# Altium schematic sheet sw_receive.SchDoc
size A3
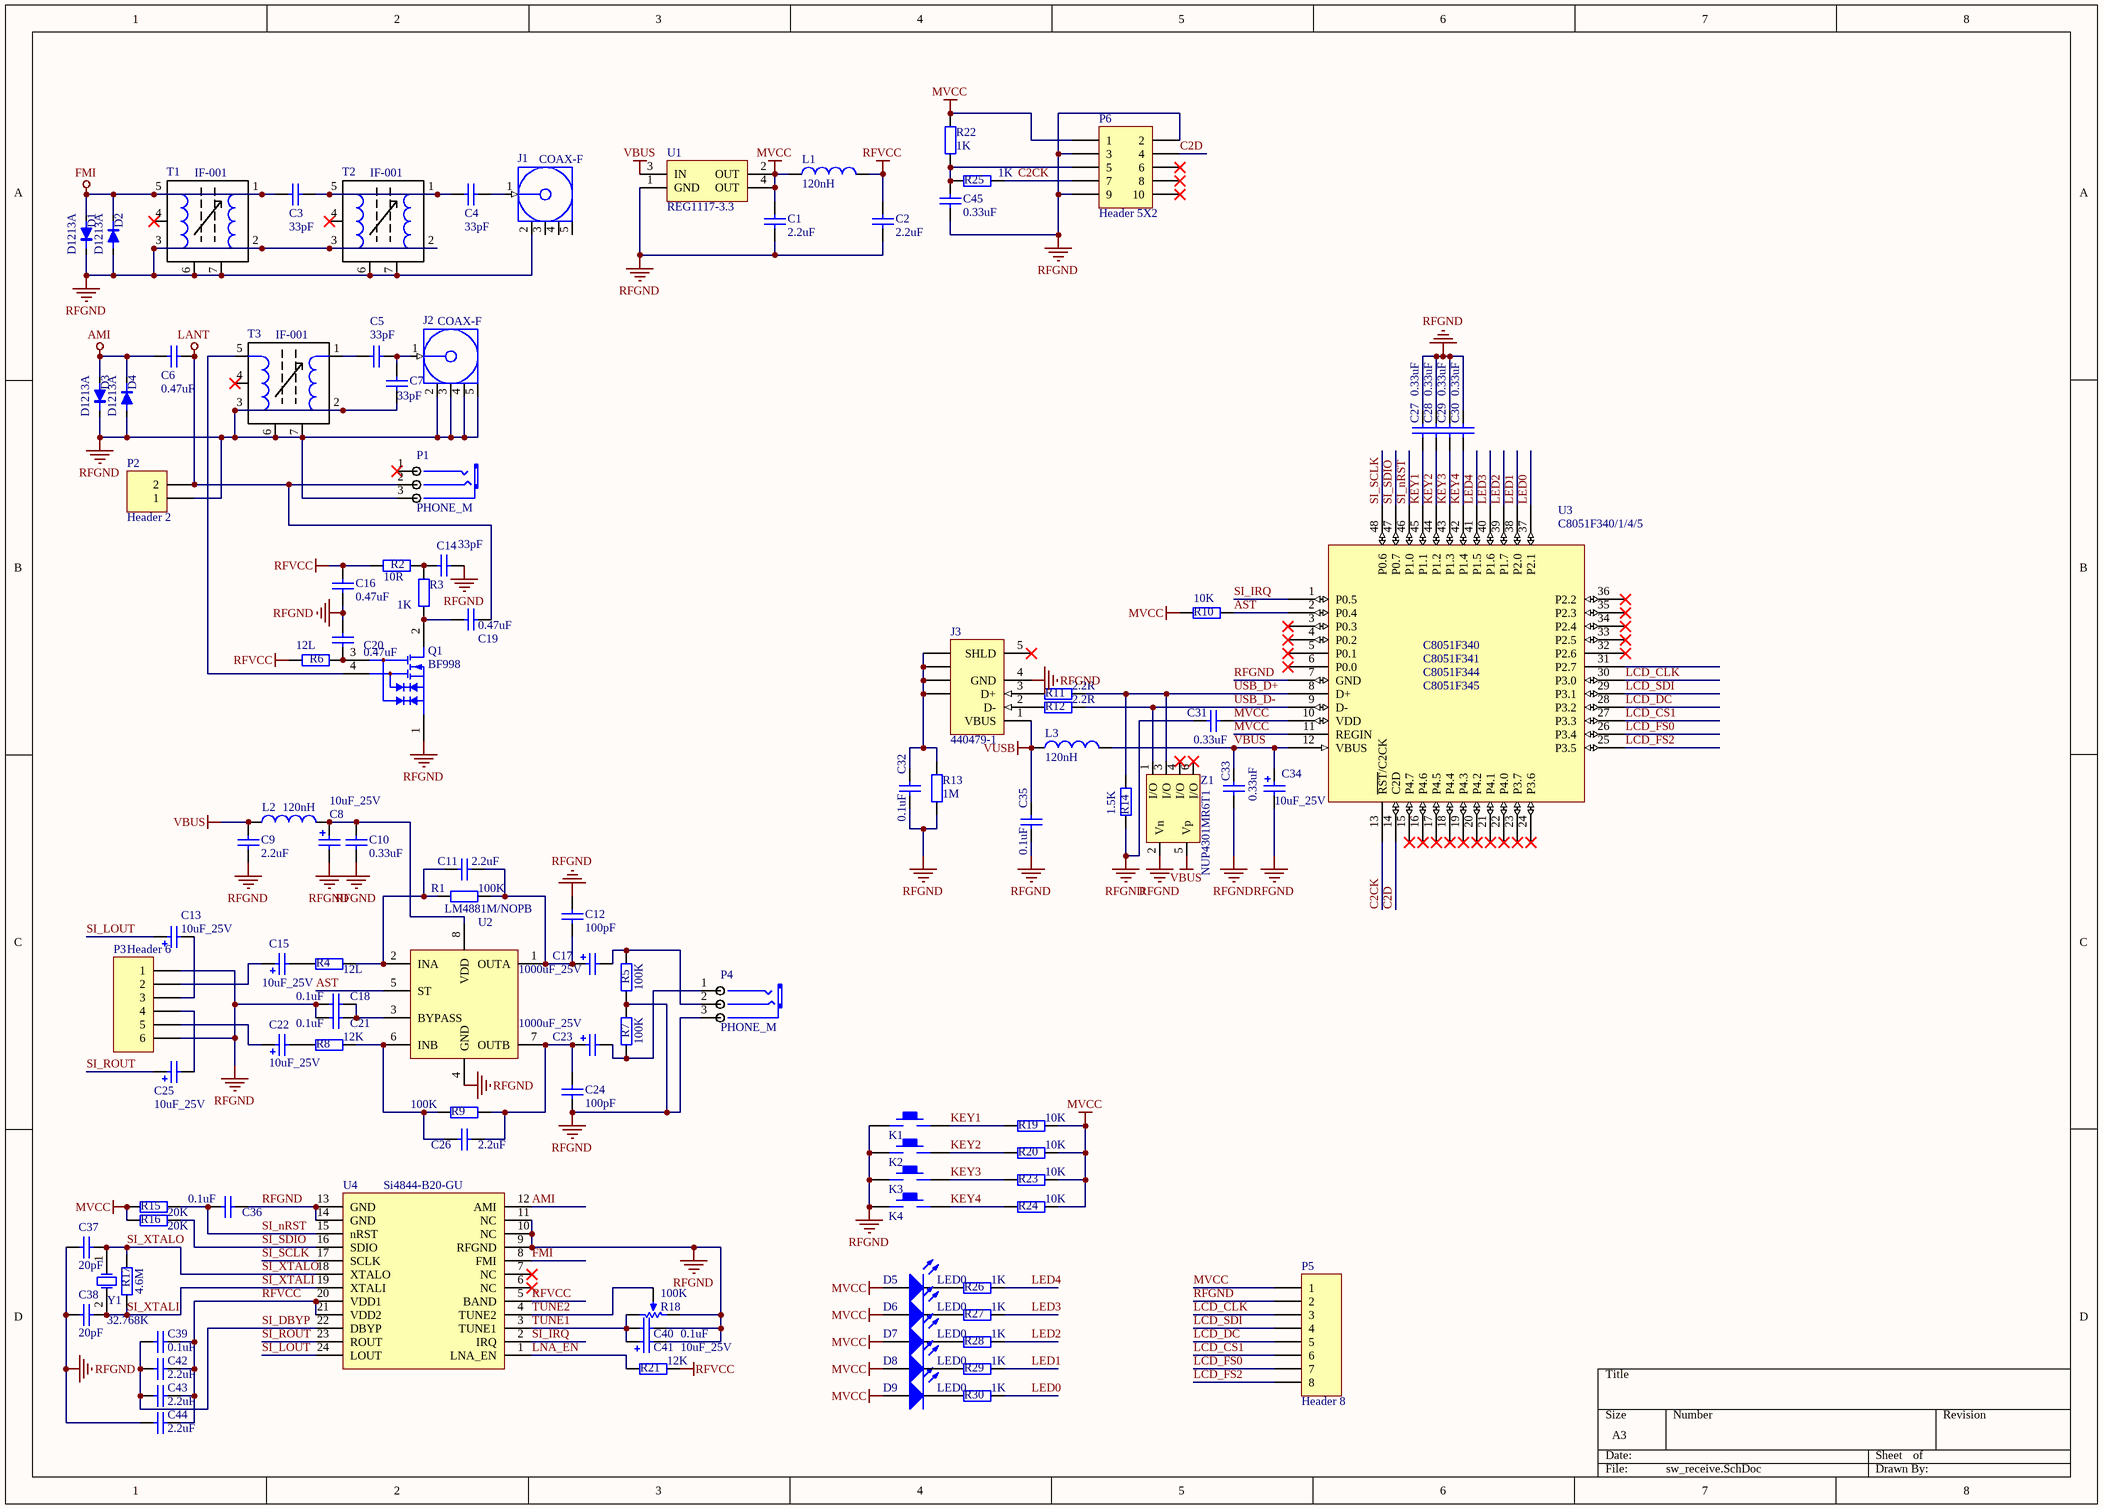
[diagram p0: sw_receive.SchDoc]

## Parts
C1  2.2uF  [0805C]
C2  2.2uF  [0805C]
C3  33pF  [0805C]
C4  33pF  [0805C]
C5  33pF  [0805C]
C6  0.47uF  [0805C]
C7  33pF  [0805C]
C8  10uF_25V  [RB2.5-6.3]
C9  2.2uF  [0805C]
C10  0.33uF  [0805C]
C11  2.2uF  [0805C]
C12  100pF  [0805C]
C13  10uF_25V  [RB2-5]
C14  33pF  [0805C]
C15  10uF_25V  [RB2-5]
C16  0.47uF  [0805C]
C17  1000uF_25V  [RB3.5-8]
C18  0.1uF  [CAPC3225L]
C19  0.47uF  [0805C]
C20  0.47uF  [0805C]
C21  0.1uF  [0805C]
C22  10uF_25V  [RB2-5]
C23  1000uF_25V  [RB3.5-8]
C24  100pF  [0805C]
C25  10uF_25V  [RB2-5]
C26  2.2uF  [0805C]
C27  0.33uF  [0805C]
C28  0.33uF  [0805C]
C29  0.33uF  [0805C]
C30  0.33uF  [0805C]
C31  0.33uF  [0805C]
C32  0.1uF  [0805C]
C33  0.33uF  [0805C]
C34  10uF_25V  [RB2.5-6.3]
C35  0.1uF  [0805C]
C36  0.1uF  [0805C]
C37  20pF  [0805C]
C38  20pF  [0805C]
C39  0.1uF  [0805C]
C40  0.1uF  [0805C]
C41  10uF_25V  [RB2.5-6.3]
C42  2.2uF  [CAPC3225L]
C43  2.2uF  [CAPC3225L]
C44  2.2uF  [CAPC3225L]
C45  0.33uF  [0805C]
D1  D1213A  [SOD-323]
D2  D1213A  [SOD-323]
D3  D1213A  [SOD-323]
D4  D1213A  [SOD-323]
D5  LED0  [LEDLight]
D6  LED0  [LEDLight]
D7  LED0  [LEDLight]
D8  LED0  [LEDLight]
D9  LED0  [LEDLight]
J1  COAX-F  [MCX5.08-H5]
J2  COAX-F  [MCX5.08-H5]
J3  440479-1  [440479]
K1  KEY_M  [KEY_M]  (value not drawn)
K2  KEY_M  [KEY_M]  (value not drawn)
K3  KEY_M  [KEY_M]  (value not drawn)
K4  KEY_M  [KEY_M]  (value not drawn)
L1  120nH  [0805R]
L2  120nH  [0805R]
L3  120nH  [3225[1210]]
P1  PHONE_M  [PHONE_ST]
P2  Header 2  [2510-2]
P3  Header 6  [RK097]
P4  PHONE_M  [PHONE_ST]
P5  Header 8  [HDR1X8]
P6  Header 5X2  [FKV10SN]
Q1  BF998  [SOT143]
R1  100K  [0805R]
R2  10R  [0805R]
R3  1K  [0805R]
R4  12L  [0805R]
R5  100K  [0805R]
R6  12L  [0805R]
R7  100K  [0805R]
R8  12K  [0805R]
R9  100K  [0805R]
R10  10K  [0805R]
R11  2.2R  [0805R]
R12  2.2R  [0805R]
R13  1M  [0805R]
R14  1.5K  [0805R]
R15  20K  [0805R]
R16  20K  [0805R]
R17  4.6M  [0805R]
R18  100K  [3590S]
R19  10K  [0805R]
R20  10K  [0805R]
R21  12K  [0805R]
R22  1K  [0805R]
R23  10K  [0805R]
R24  10K  [0805R]
R25  1K  [0805R]
R26  1K  [0805R]
R27  1K  [0805R]
R28  1K  [0805R]
R29  1K  [0805R]
R30  1K  [0805R]
T1  IF-001  [IF_10X10]
T2  IF-001  [IF_10X10]
T3  IF-001  [IF_10X10]
U1  REG1117-3.3  [ZZ311]
U2  LM4881M/NOPB  [SO-8]
U3  C8051F340/1/4/5  [TQFP-48]
U4  Si4844-B20-GU  [SSOP24-0.635]
Y1  32.768K  [Crystal32]
Z1  NUP4301MR6T1  [TSOP-6]

## Nets
AMI: C6.1 D3.1(A) D4.2(K) U4.12(AMI)
FMI: C3.2 D1.1(A) D2.2(K) T1.1 T1.5 U4.8(FMI)
LANT: C6.2 C19.1 P1.2(CHR) P2.2
MVCC: C1.2 C31.1 D5.1(A) D6.1(A) D7.1(A) D8.1(A) D9.1(A) L1.1 P5.1 P6.1 R10.1 R15.1 R16.1 R19.2 R20.2 R22.2 R23.2 R24.2 U1.2(OUT) U1.4(OUT) U3.10(VDD) U3.11(REGIN)
RFGND: C1.1 C2.1 C7.2 C8.2 C9.1 C10.1 C12.2 C14.2 C16.1 C18.1 C20.2 C21.1 C24.2 C27.1 C28.1 C29.1 C30.1 C31.2 C32.2 C33.1 C34.2 C35.2 C36.2 C37.2 C38.2 C40.2 C41.2 C44.1 C45.1 D1.2(K) D2.1(A) D3.2(K) D4.1(A) J1.2(GND) J2.2(GND) J2.3(GND) J2.4(GND) J2.5(GND) J3.4(GND) K1.1 K2.1 K3.1 K4.1 P1.3(COM) P2.1 P3.1 P3.6 P4.3(COM) P5.2 P6.2 P6.3 P6.9 Q1.1(S) R5.2 R7.2 R13.1 R14.1 R18.2(BOT) T1.2 T1.3 T1.6 T1.7 T2.2 T2.3 T2.6 T2.7 T3.2 T3.3 T3.6 T3.7 U1.1(GND) U2.4(GND) U3.7(GND) U4.9(RFGND) U4.10(NC) U4.11(NC) U4.13(GND) U4.14(GND) Z1.2(Vn)
RFVCC: C2.2 C16.2 C39.2 C42.2 C43.2 C44.2 L1.2 R2.2 R6.2 R21.2 U4.5(BAND) U4.20(VDD1) U4.21(VDD2)
VBUS: C9.2 C33.2 C34.1 L2.1 L3.2 U1.3(IN) U3.12(VBUS) Z1.5(Vp)
VUSB: C35.1 J3.1(VBUS) L3.1
AST: R10.2 U2.5(ST) U3.2(P0.4)
C2CK: P6.7 R25.2 U3.13(~{RST}/C2CK)
C2D: P6.4 U3.14(C2D)
KEY1: C27.2 K1.2 R19.1 U3.45(P1.1)
KEY2: C28.2 K2.2 R20.1 U3.44(P1.2)
KEY3: C29.2 K3.2 R23.1 U3.43(P1.3)
KEY4: C30.2 K4.2 R24.1 U3.42(P1.4)
LCD_CLK: P5.3 U3.30(P3.0)
LCD_CS1: P5.6 U3.27(P3.3)
LCD_DC: P5.5 U3.28(P3.2)
LCD_FS0: P5.7 U3.26(P3.4)
LCD_FS2: P5.8 U3.25(P3.5)
LCD_SDI: P5.4 U3.29(P3.1)
LED0: R30.1 U3.37(P2.1)
LED1: R29.1 U3.38(P2.0)
LED2: R28.1 U3.39(P1.7)
LED3: R27.1 U3.40(P1.6)
LED4: R26.1 U3.41(P1.5)
LNA_EN: R21.1 U4.1(LNA_EN)
SI_DBYP: C39.1 C42.1 C43.1 U4.22(DBYP)
SI_IRQ: U3.1(P0.5) U4.2(IRQ)
SI_LOUT: C13.1 U4.24(LOUT)
SI_nRST: C36.1 R15.2 U3.46(P1.0) U4.15(nRST)
SI_ROUT: C25.1 U4.23(ROUT)
SI_SCLK: U3.48(P0.6) U4.17(SCLK)
SI_SDIO: R16.2 U3.47(P0.7) U4.16(SDIO)
SI_XTALI: C38.1 R17.1 U4.19(XTALI) Y1.2(OSC2)
SI_XTALO: C37.1 R17.2 U4.18(XTALO) Y1.1(OSC1)
TUNE1: C40.1 C41.1 R18.1(TOP) U4.3(TUNE1)
TUNE2: R18.3(TAP) U4.4(TUNE2)
USB_D+: R11.2 R14.2 U3.8(D+) Z1.3(I/O)
USB_D-: R12.2 U3.9(D-) Z1.1(I/O)
NetC3_1: C3.1 C4.2 T2.1 T2.5
NetC4_1: C4.1 J1.1(Signal)
NetC5_1: C5.1 C7.1 J2.1(Signal)
NetC5_2: C5.2 T3.1
NetC8_1: C8.1 C10.2 L2.2 U2.8(VDD)
NetC11_1: C11.1 R1.1 R4.2 U2.2(INA)
NetC11_2: C11.2 C12.1 C17.1 R1.2 U2.1(OUTA)
NetC13_2: C13.2 P3.3
NetC14_1: C14.1 R2.1 R3.2
NetC15_1: C15.1 P3.2
NetC15_2: C15.2 R4.1
NetC17_2: C17.2 P4.2(CHR) R5.1
NetC18_2: C18.2 C21.2 U2.3(BYPASS)
NetC19_2: C19.2 Q1.2(D) R3.1
NetC20_1: C20.1 Q1.3(G2) R6.1
NetC22_1: C22.1 P3.5
NetC22_2: C22.2 R8.1
NetC23_1: C23.1 C24.1 C26.2 R9.1 U2.7(OUTB)
NetC23_2: C23.2 P4.1(CHL) R7.1
NetC25_2: C25.2 P3.4
NetC26_1: C26.1 R8.2 R9.2 U2.6(INB)
NetC32_1: C32.1 J3.6(SHLD) J3.7(SHLD) J3.8(SHLD) J3.9(SHLD) R13.2
NetC45_2: C45.2 P6.5 R22.1 R25.1
NetD5_2: D5.2(K) R26.2
NetD6_2: D6.2(K) R27.2
NetD7_2: D7.2(K) R28.2
NetD8_2: D8.2(K) R29.2
NetD9_2: D9.2(K) R30.2
NetJ3_2: J3.2(D-) R12.1
NetJ3_3: J3.3(D+) R11.1
NetQ1_4: Q1.4(G1) T3.5

Not connected (* = marked no-connect by the designer): J1 3(GND) 4(GND) 5(GND); J3 5(SHLD)*; P1 1(CHL)*; P6 6* 8* 10*; T1 4*; T2 4*; T3 4*; U3 3(P0.3)* 4(P0.2)* 5(P0.1)* 6(P0.0)* 15(P4.7)* 16(P4.6)* 17(P4.5)* 18(P4.4)* 19(P4.3)* 20(P4.2)* 21(P4.1)* 22(P4.0)* 23(P3.7)* 24(P3.6)* 31(P2.7) 32(P2.6)* 33(P2.5)* 34(P2.4)* 35(P2.3)* 36(P2.2)*; U4 6(NC)* 7(NC)*; Z1 4(I/O)* 6(I/O)*

## Notes on the sheet
- (in symbol C8051F340/1/4/5) C8051F340; C8051F341; C8051F344; C8051F345

## Library data of the parts
C1-C7 C9-C11 C14 C16 C18-C21 C26-C33 C35-C40 C42-C45 = Cap: Capacitor; Value: 100pF; Published: 8-Jun-2000; LatestRevisionDate: 17-Jul-2002; LatestRevisionNote: Re-released for DXP Platform.; PackageReference: RAD-0.3; Publisher: Altium Limited
C8 C13 C15 C17 C22 C23 C25 C34 C41 = Cap Pol2: Polarized Capacitor (Axial); Value: 100pF; Published: 8-Jun-2000; LatestRevisionDate: 17-Jul-2002; LatestRevisionNote: Re-released for DXP Platform.; PackageReference: POLAR0.8; Publisher: Altium Limited
C12 C24 = Cap: Capacitor; Published: 8-Jun-2000; LatestRevisionDate: 17-Jul-2002; LatestRevisionNote: Re-released for DXP Platform.; PackageReference: RAD-0.3; Publisher: Altium Limited; Value: 100pF
D1-D4 = DIODE1
D5-D9 = LED0: Typical INFRARED GaAs LED; Published: 8-Jun-2000; LatestRevisionDate: 08-Jul-2005; LatestRevisionNote: Mech Layer 1 removed.; PackageReference: LED-0; Publisher: Altium Limited
J1 J2 = COAX-F: RF Coaxial PCB Connector, MCX; Thru-Hole, Right-Angle Mount Socket, Blunt Post Terminal, 50 Ohm Impedance; PCB_Layout: Complies with manufacturer's recommendation.; DrillSize: Corresponds to nominal value.; Published: 15-Jul-2004; LatestRevisionDate: 15-Jul-2004; LatestRevisionNote: Component Replaced.; DatasheetDocument: 30-May-2003; PackageDocument: 04-Jul-1999; PackageReference: 919-119J-51AX; Publisher: Altium Limited; ComponentLink1Description: Manufacturer Link; ComponentLink1URL: http://www.amphenolrf.com/
J3 = 440479-1: USB 2.0, Right Angle, SMT, AB Type, Receptacle, 5 Position, Black; ContactMaterial: Phosphor Bronze; ContactPlating: Gold (30) over Nickel; PCB_Layout: Complies with manufacturer's recommendation.; DrillSize: Corresponds to nominal value.; PanelGround: Without; Published: 15-Jul-2004; DatasheetDocument: 28-Jan-2003; PackageDocument: 28-Jan-2003; PackageReference: 440479; Publisher: Altium Limited; HousingMaterial: Thermoplastic; ComponentLink1Description: Manufacturer Link; ComponentLink1URL: http://www.tycoelectronics.com/; ComponentLink2Description: Packaging Specification; ComponentLink2URL: http://ecommas.tycoelectronics.com/commerce/DocumentDelivery/DDEController?Action=showdoc&DocId=Customer+Drawing%7F440479%7FD%7Fpdf%7FEnglish%7FC_440479_D.pdf
L1-L3 = Inductor: Code_IEC: 1005; Value: 10mH; Published: 8-Jun-2000; LatestRevisionDate: 17-Jul-2002; LatestRevisionNote: Re-released for DXP Platform.; PackageReference: 0402-A; Publisher: Altium Limited; Code_JEITA: 0402
P2 = Header 2: Header, 2-Pin; LatestRevisionDate: 17-Jul-2002; LatestRevisionNote: Re-released for DXP Platform.; Publisher: Altium Limited
P3 = Header 6: Header, 6-Pin; LatestRevisionDate: 17-Jul-2002; LatestRevisionNote: Re-released for DXP Platform.; Publisher: Altium Limited
P5 = Header 8: Header, 8-Pin; LatestRevisionDate: 17-Jul-2002; LatestRevisionNote: Re-released for DXP Platform.; Publisher: Altium Limited
P6 = Header 5X2: Header, 5-Pin, Dual row; LatestRevisionDate: 17-Jul-2002; LatestRevisionNote: Re-released for DXP Platform.; Publisher: Altium Limited
Q1 = BF998: Silicon N-channel Dual-gate MOSFET; Published: 17-Sep-2003; DatasheetVersion: Aug-1996; PackageVersion: Sep-1996; PackageReference: SOT143; Publisher: Altium Limited; PackageDescription: SOT-143; 4 Leads; Body 3 x 2.5 mm, inc. leads (LxW max); ComponentLink1Description: Manufacturer Link; ComponentLink1URL: http://www.semiconductors.philips.com/; ComponentLink2Description: Datasheet; ComponentLink2URL: http://www.semiconductors.philips.com/acrobat/datasheets/BF998_2.pdf
R1 R2 R4-R17 R19-R21 R23 R24 = Res2: Resistor; Value: 1K; Published: 8-Jun-2000; LatestRevisionDate: 17-Jul-2002; LatestRevisionNote: Re-released for DXP Platform.; PackageReference: AXIAL-0.4; Publisher: Altium Limited
R3 R22 R25-R30 = Res2: Resistor; Published: 8-Jun-2000; LatestRevisionDate: 17-Jul-2002; LatestRevisionNote: Re-released for DXP Platform.; PackageReference: AXIAL-0.4; Publisher: Altium Limited; Value: 1K
R18 = RPot: Potentiometer; Sim Note: Enter the Resistance value and the set point into parameter fields.; Set Position: 0.5; Value: 1K; Published: 8-Jun-2000; LatestRevisionDate: 17-Jul-2002; LatestRevisionNote: Re-released for DXP Platform.; PackageReference: VR5; Publisher: Altium Limited
U1 = REG1117-3.3: 800mA and 1A Low Dropout Positive Regulator 2.85V, 3.3V, 5V, and Adjustable; Published: 8-Jun-2000; LatestRevisionDate: 17-Jul-2002; LatestRevisionNote: Re-released for DXP Platform.; DatasheetVersion: Sep-1997; PackageVersion: revC; PackageReference: ZZ311; Publisher: Altium Limited; PackageDescription: SOT-223/SC-73; 4 Leads; Body 6.7 x 7.3 mm, inc. leads (LxW max); ComponentLink1Description: Manufacturer Link; ComponentLink1URL: http://www.ti.com/; ComponentLink2Description: Datasheet; ComponentLink2URL: http://www-s.ti.com/sc/ds/REG1117.pdf
U4 = Si4844-B20-GU: 模拟调谐数字显示 AM/FM/SW 收音机
Y1 = XTAL: Crystal Oscillator; Published: 8-Jun-2000; LatestRevisionDate: 17-Jul-2002; LatestRevisionNote: Re-released for DXP Platform.; PackageReference: R38; Publisher: Altium Limited
Z1 = NUP4301MR6T1: ESD protection